# Altium schematic sheet MS35775 step motor driver.SchDoc
size A4; SheetNumber: 3; SheetTotal: 12
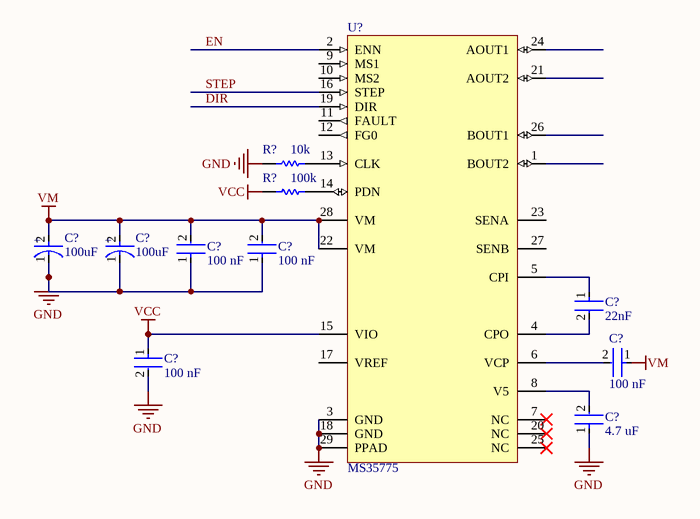
[diagram p0: MS35775 step motor driver.SchDoc]

## Parts
(Parts that share a designator on the sheet are numbered #1, #2 ... from top to bottom, then left to right.)
C?#1  Capacitance: 100uF  [FP-TQD8-MFG]  (hidden comment: EEE-TQV101XAP)
C?#2  Capacitance: 100uF  [FP-TQD8-MFG]  (hidden comment: EEE-TQV101XAP)
C?#3  Capacitance: 100 nF  [FP-CC0603-DA-MFG]  (hidden comment: CC0603KRX7R9BB104)
C?#4  Capacitance: 100 nF  [FP-CC0603-DA-MFG]  (hidden comment: CC0603KRX7R9BB104)
C?#5  Capacitance: 22nF  [FP-CC0603-DA-MFG]  (hidden comment: CC0603KRX7R9BB223)
C?#6  Capacitance: 100 nF  [FP-CC0603-DA-MFG]  (hidden comment: CC0603KRX7R9BB104)
C?#7  Capacitance: 100 nF  [FP-CC0603-DA-MFG]  (hidden comment: CC0603KRX7R9BB104)
C?#8  Capacitance: 4.7 uF  [FP-CC0603-DA-MFG]  (hidden comment: CC0603MRX5R5BB475)
R?#1  Resistance: 10k  [RESC1608X55X25LL10T15]  (hidden comment: RC0603FR-1310KL)
R?#2  Resistance: 100k  [RESC1608X55X25LL10T15]  (hidden comment: RC0603JR-10100KL)
U?  MS35775  [PQFN50P500X500X90_HS-29N]

## Nets
GND: C?#1.1(C) C?#2.1(C) C?#3.1 C?#4.1 C?#6.2 C?#8.1 R?#1.1 U?.3(GND) U?.18(GND) U?.29(PPAD)
VM: C?#1.2(A) C?#2.2(A) C?#3.2 C?#4.2 C?#7.1 U?.22(VM) U?.28(VM)
VСС: C?#6.1 R?#2.2 U?.15(VIO)
DIR: U?.19(DIR)
EN: U?.2(ENN)
STEP: U?.16(STEP)
NetC?#5_1: C?#5.1 U?.5(CPI)
NetC?#5_2: C?#5.2 U?.4(CPO)
NetC?#7_2: C?#7.2 U?.6(VCP)
NetC?#8_2: C?#8.2 U?.8(V5)
NetR?#1_2: R?#1.2 U?.13(CLK)
NetR?#2_1: R?#2.1 U?.14(PDN)

Not connected (* = marked no-connect by the designer): U? 1(BOUT2) 7(NC)* 9(MS1) 10(MS2) 11(FAULT) 12(FG0) 17(VREF) 20(NC)* 21(AOUT2) 23(SENA) 24(AOUT1) 25(NC)* 26(BOUT1) 27(SENB)

## Notes on the sheet
- (in symbol CMP-05427-000054-1) +

## Library data of the parts
C?#1 C?#2 = CMP-05427-000054-1: CAP ALUM 100UF 20% 35V SMD; Ripple Current: 197mA; ESR (Equivalent Series Resistance): 300mR; Life (Hours): 2000Hour; Lead Diameter: 0.65mm; Diameter: 6.3mm; Termination: SMD/SMT; Package Quantity: 900; Min Operating Temperature: -40°C; Mount: Surface Mount; Series: TQ; Height: 7.7mm; Length: 7.7mm; Max Operating Temperature: 125°C; Voltage Rating (DC): 35V; Voltage: 35V; Construction: Cylindrical; Ripple Current (AC): 197mA; Packaging: Tape and Reel; Lead Free: Lead Free; Height - Seated (Max): 0.315inch; Number of Pins: 8; Voltage Rating: 35V; Case/Package: Radial; Tolerance: 20%; REACH SVHC: No SVHC; Lead Pitch: 1.8mm; RoHS Compliant: Yes
C?#3 C?#4 C?#6 C?#7 = CMP-2100-03601-2: CAP CER 0.1UF 50V X7R 0603; Manufacturer: YAGEO; Material: Ceramic; Temperature Coefficient: 15%; Tolerance: 0.1; Value: 100 nF; Height: 0.9mm; Voltage: 50 V; ComponentLink2Description: Datasheet; Device Class L2: Capacitors; Temperature Range High: +125°C; Category: Cap; Footprint Url: http://www.yageo.com/exep/pages/download/literatures/UPY-C_GEN_24.pdf; ComponentLink2URL: http://www.yageo.com/documents/recent/UPY-GPHC_X7R_6.3V-to-50V_18.pdf; Package: CC0603-DA; Temperature: -55°C to +125°C; Voltage Rating: 50 V; Temperature Characteristic: X7R; Device Class L1: Passive Components; Temperature Range Low: -55°C; Manufacturer Part Number: CC0603KRX7R9BB104; RoHS: TRUE; Automotive: No; Device Class L3: Ceramic Capacitors; Octopart: https://octopart.com/cc0603krx7r9bb104-yageo-42244635; Mouser Description: Multilayer Ceramic Capacitor, CC Series, 0.1 - F, - 10%, X7R, 50 V, 0603 [1608 Metric]; Lead Free: Yes; Digikey Description: CAP CER 0.1UF 50V X7R 0603
C?#5 = CMP-2100-03602-3: CAP CER 0.022UF 50V X7R 0603; Dielectric Material: Ceramic; Insulation Resistance: 100GR; Tolerance: 10%; Thickness: 0.035inch; Case/Package: 0603; Packaging: Tape and Reel; Voltage Rating (DC): 50V; Length: 1.6mm; Depth: 0.8mm; Dielectric: X7R; Resistor Type: Ceramic; Min Operating Temperature: -55°C; Number of Pins: 2; Series: CC; Mount: Surface Mount; Max Operating Temperature: 125°C; Case Code (Imperial): 0603; Width: 0.031inch; Halogen Free: Halogen Free; Lead Free: Lead Free; Voltage: 50V; RoHS Compliant: Yes; Package Quantity: 1; Height: 0.8mm; REACH SVHC: No SVHC; Voltage Rating: 50V; Case Code (Metric): 1608; Termination: SMD/SMT; Radiation Hardening: No
C?#8 = CMP-1035-02782-2: CAP CER 4.7UF 6.3V X5R 0603; Manufacturer: YAGEO; Tolerance: 0.2; Temperature Coefficient: 15%; Material: Ceramic; Voltage Rating: 6.3 V; Package: CC0603-DA; Voltage: 6.3 V; Temperature Characteristic: X5R; Automotive: No; Temperature: -55°C to +125°C; Temperature Range Low: -55°C; Value: 4.7 uF; Temperature Range High: +125°C; Digikey Description: CAP CER 4.7UF 6.3V X5R 0603; Mouser Description: Multilayer Ceramic Capacitors MLCC - SMD/SMT 4.7uF 6.3V X5R 20%; Device Class L2: Capacitors; Lead Free: Yes; Footprint Url: http://www.yageo.com/exep/pages/download/literatures/UPY-C_GEN_24.pdf; ComponentLink2URL: http://www.yageo.com/documents/recent/UPY-GPHC_X7R_6.3V-to-50V_18.pdf; Height: 0.9mm; Device Class L3: Ceramic Capacitors; ComponentLink2Description: Datasheet; RoHS: TRUE; Device Class L1: Passive Components; Octopart: https://octopart.com/cc0603mrx5r5bb475-yageo-8376541; Manufacturer Part Number: CC0603MRX5R5BB475; Category: Cap
R?#1 = CMP-1659-00054-1: Chip Resistor, 10 KOhm, +/- 1%, 0.1 W, -55 to 155 degC, 0603 (1608 Metric), RoHS, Tape and Reel; Voltage Rating: 100 mV; Type (Resistor): Wirewound; Power Rating: 2 W; Min Operating Temperature: -55degC; ComponentLink2Description: Datasheet; Packaging: Bulk; Case/Package: Axial; ComponentLink2URL: http://www.yageo.com/documents/recent/PYu-RC_Group_51_RoHS_L_04.pdf; ComponentLink1URL: http://www.yageo.com/; RoHSCompliant: True; Length: 10.6 mm; Mount: Through Hole; Pins: 2; Diameter: 2.4 mm; PackageDescription: 2-Pin Surface Mount Device, Body 1.6 x 0.8 mm; Tolerance: 1%; REACH SVHC: Unknown; PackageReference: 0603; Package Quantity: 10; ComponentLink1Description: Manufacturer URL; DatasheetVersion: Rev. 4, 02/2016; Max Operating Temperature: 275degC
R?#2 = CMP-2000-04301-1: Manufacturer: Yageo; Part Number: RC0603JR-10100KL
U? = MS35775: Low noise 256 subdivision microstepping motor driver.; Value: MS35775